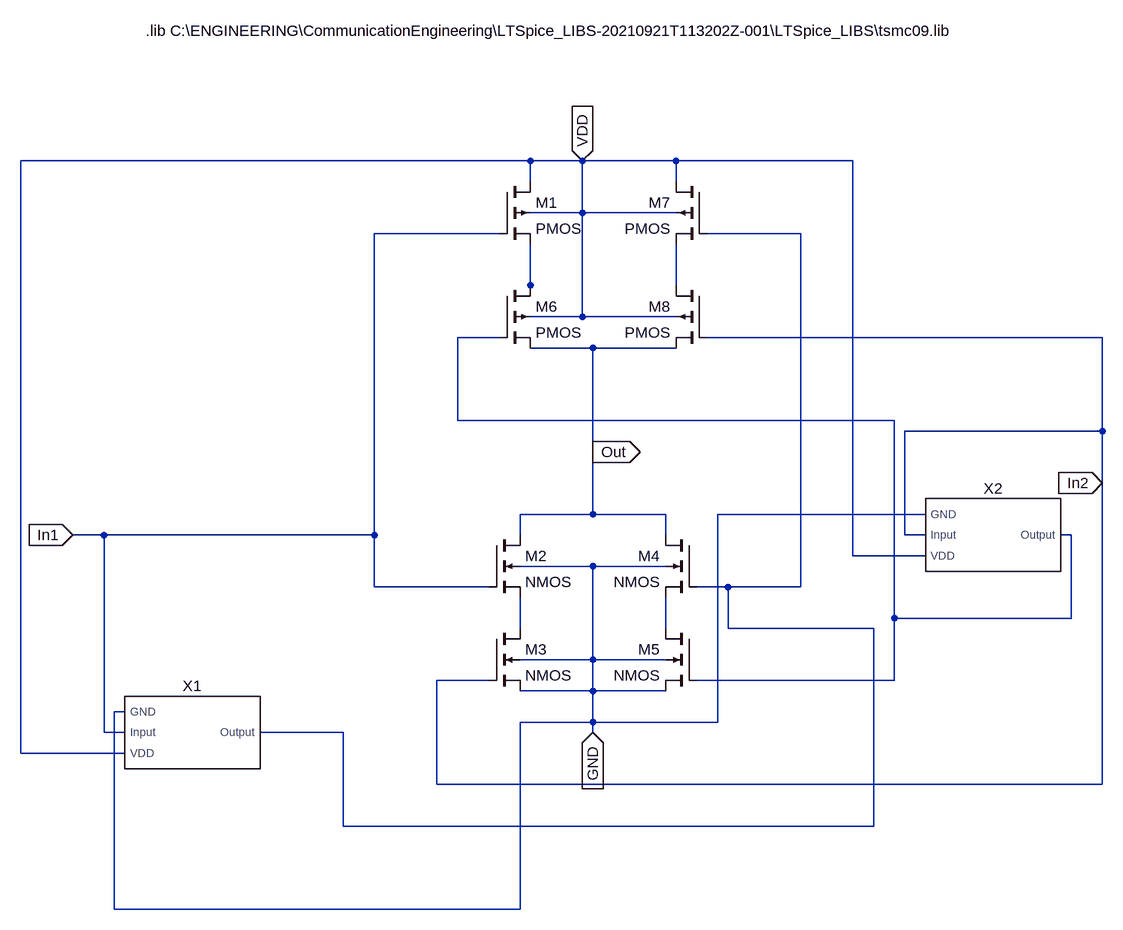
[diagram p0: schematic xor_model3EXP.asc]
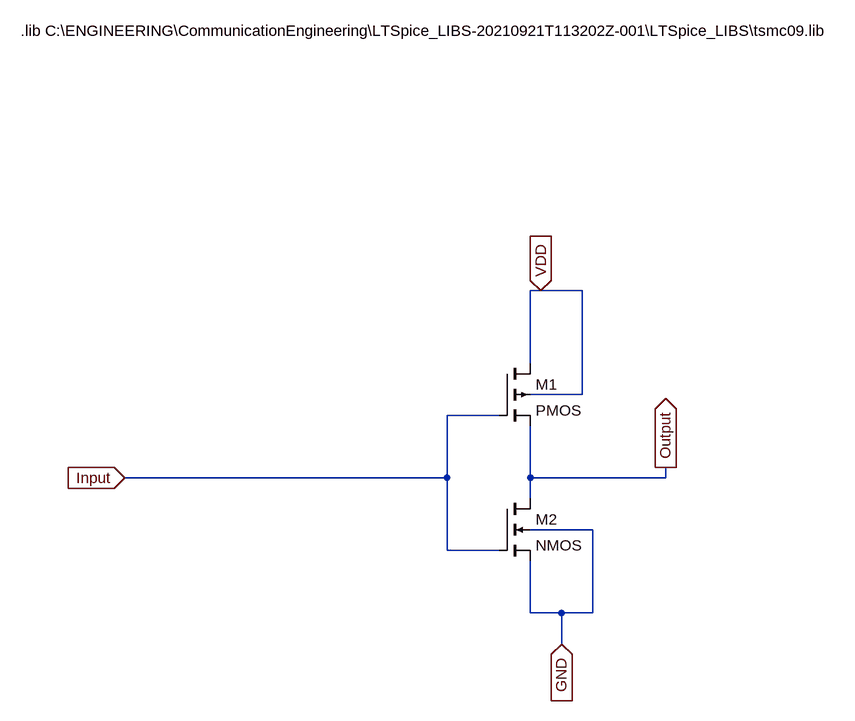
[diagram p1: sub-circuit not_model3exp.asc]
xor_model3EXP.asc, the LTspice schematic file:
Version 4
SHEET 1 2196 1364
WIRE 768 208 -16 208
WIRE 848 208 768 208
WIRE 992 208 848 208
WIRE 1264 208 992 208
WIRE 768 240 768 208
WIRE 992 240 992 208
WIRE 848 288 848 208
WIRE 848 288 768 288
WIRE 992 288 848 288
WIRE 720 320 528 320
WIRE 1184 320 1040 320
WIRE 768 400 768 336
WIRE 992 400 992 336
WIRE 768 416 768 400
WIRE 848 448 848 288
WIRE 848 448 768 448
WIRE 992 448 848 448
WIRE 720 480 656 480
WIRE 1648 480 1040 480
WIRE 864 496 768 496
WIRE 992 496 864 496
WIRE 656 608 656 480
WIRE 1328 608 656 608
WIRE 1648 624 1648 480
WIRE 1648 624 1344 624
WIRE 864 656 864 496
WIRE 1648 704 1648 624
WIRE 864 752 864 656
WIRE 864 752 752 752
WIRE 976 752 864 752
WIRE 1376 752 1056 752
WIRE 112 784 64 784
WIRE 528 784 528 320
WIRE 528 784 112 784
WIRE 752 784 752 752
WIRE 976 784 976 752
WIRE 1344 784 1344 624
WIRE 1376 784 1344 784
WIRE 1600 784 1584 784
WIRE 1264 816 1264 208
WIRE 1376 816 1264 816
WIRE 864 832 752 832
WIRE 976 832 864 832
WIRE 528 864 528 784
WIRE 704 864 528 864
WIRE 1072 864 1024 864
WIRE 1184 864 1184 320
WIRE 1184 864 1072 864
WIRE 1328 912 1328 608
WIRE 1600 912 1600 784
WIRE 1600 912 1328 912
WIRE 752 928 752 880
WIRE 976 928 976 880
WIRE 1072 928 1072 864
WIRE 1296 928 1072 928
WIRE 864 976 864 832
WIRE 864 976 752 976
WIRE 976 976 864 976
WIRE 704 1008 624 1008
WIRE 1328 1008 1328 912
WIRE 1328 1008 1024 1008
WIRE 864 1024 864 976
WIRE 864 1024 752 1024
WIRE 976 1024 864 1024
WIRE 144 1056 128 1056
WIRE 864 1072 864 1024
WIRE 864 1072 752 1072
WIRE 1056 1072 1056 752
WIRE 1056 1072 864 1072
WIRE 112 1088 112 784
WIRE 144 1088 112 1088
WIRE 480 1088 352 1088
WIRE 864 1088 864 1072
WIRE -16 1120 -16 208
WIRE 144 1120 -16 1120
WIRE 624 1168 624 1008
WIRE 1648 1168 1648 704
WIRE 1648 1168 624 1168
WIRE 480 1232 480 1088
WIRE 1296 1232 1296 928
WIRE 1296 1232 480 1232
WIRE 128 1360 128 1056
WIRE 752 1360 752 1072
WIRE 752 1360 128 1360
FLAG 64 784 In1
IOPIN 64 784 In
FLAG 1648 704 In2
IOPIN 1648 704 In
FLAG 864 656 Out
IOPIN 864 656 Out
FLAG 848 208 VDD
IOPIN 848 208 In
FLAG 864 1088 GND
IOPIN 864 1088 In
SYMBOL pmos4 720 240 R0
SYMATTR InstName M1
SYMATTR Value2 l=90n w=440n
SYMBOL nmos4 704 784 R0
SYMATTR InstName M2
SYMATTR Value2 l=90n w=220n
SYMBOL nmos4 704 928 R0
SYMATTR InstName M3
SYMATTR Value2 l=90n w=220n
SYMBOL nmos4 1024 784 M0
SYMATTR InstName M4
SYMATTR Value2 l=90n w=220n
SYMBOL nmos4 1024 928 M0
SYMATTR InstName M5
SYMATTR Value2 l=90n w=220n
SYMBOL pmos4 720 400 R0
SYMATTR InstName M6
SYMATTR Value2 l=90n w=440n
SYMBOL pmos4 1040 240 M0
SYMATTR InstName M7
SYMATTR Value2 l=90n w=440n
SYMBOL pmos4 1040 400 M0
SYMATTR InstName M8
SYMATTR Value2 l=90n w=440n
SYMBOL not_model3EXP 240 1088 R0
SYMATTR InstName X1
SYMBOL not_model3EXP 1472 784 R0
SYMATTR InstName X2
TEXT 176 8 Left 2 !.lib C:\\ENGINEERING\\CommunicationEngineering\\LTSpice_LIBS-20210921T113202Z-001\\LTSpice_LIBS\\tsmc09.lib

not_model3exp.asc, the sub-circuit schematic file:
Version 4
SHEET 1 888 680
WIRE 240 -96 224 -96
WIRE 304 -96 240 -96
WIRE 224 16 224 -96
WIRE 304 64 304 -96
WIRE 304 64 224 64
WIRE 176 96 96 96
WIRE 96 192 96 96
WIRE 96 192 -400 192
WIRE 224 192 224 112
WIRE 432 192 432 176
WIRE 432 192 224 192
WIRE 224 224 224 192
WIRE 320 272 224 272
WIRE 96 304 96 192
WIRE 176 304 96 304
WIRE 224 400 224 320
WIRE 272 400 224 400
WIRE 320 400 320 272
WIRE 320 400 272 400
WIRE 272 448 272 400
FLAG -400 192 Input
IOPIN -400 192 In
FLAG 432 176 Output
IOPIN 432 176 Out
FLAG 240 -96 VDD
IOPIN 240 -96 In
FLAG 272 448 GND
IOPIN 272 448 In
SYMBOL pmos4 176 16 R0
SYMATTR InstName M1
SYMATTR Value2 l=90n w=440n
SYMBOL nmos4 176 224 R0
SYMATTR InstName M2
SYMATTR Value2 l=90n w=220n
TEXT -560 -496 Left 2 !.lib C:\\ENGINEERING\\CommunicationEngineering\\LTSpice_LIBS-20210921T113202Z-001\\LTSpice_LIBS\\tsmc09.lib

The netlist it stands for:
* xor_model3EXP.asc
M1 VDD In1 N002 VDD PMOS l=90n w=440n
M2 Out In1 N005 GND NMOS l=90n w=220n
M3 N005 In2 GND GND NMOS l=90n w=220n
M4 Out N001 N006 GND NMOS l=90n w=220n
M5 N006 N004 GND GND NMOS l=90n w=220n
M6 N002 N004 Out VDD PMOS l=90n w=440n
M7 VDD N001 N003 VDD PMOS l=90n w=440n
M8 N003 In2 Out VDD PMOS l=90n w=440n
XX1 GND In1 VDD N001 not_model3exp
XX2 GND In2 VDD N004 not_model3exp

* block symbol definitions
.subckt not_model3exp GND Input VDD Output
M1 VDD Input Output VDD PMOS l=90n w=440n
M2 Output Input GND GND NMOS l=90n w=220n
.lib C:\ENGINEERING\CommunicationEngineering\LTSpice_LIBS-20210921T113202Z-001\LTSpice_LIBS\tsmc09.lib
.ends not_model3exp

.model NMOS NMOS
.model PMOS PMOS
.lib standard.mos
.lib C:\ENGINEERING\CommunicationEngineering\LTSpice_LIBS-20210921T113202Z-001\LTSpice_LIBS\tsmc09.lib
.backanno
.end